# Altium schematic sheet LM2596S_5.0.SchDoc
size A4; SheetNumber: 1; SheetTotal: 1
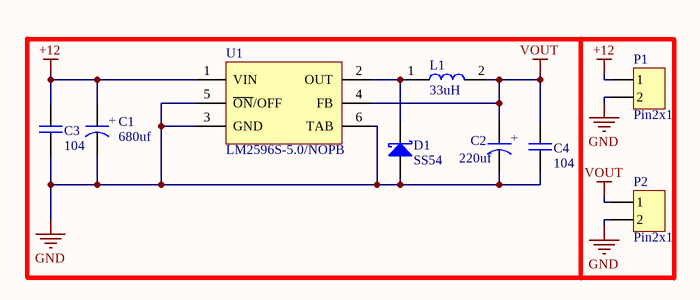
[diagram p0: LM2596S_5.0.SchDoc]

## Parts
C1  680uf  [CAP-SMD-B]
C2  220uf  [CAP-SMD-B]
C3  104  [0603C]
C4  104  [0603C]
D1  SS54  [SMC]
L1  33uH  [CDRH74]
P1  Pin2x1  [5.08A-2PIN]
P2  Pin2x1  [5.08A-2PIN]
U1  LM2596S-5.0/NOPB  [TO263-5A]

## Nets
+12: C1.2 C3.2 P1.1 U1.1(VIN)
GND: C1.1 C2.1 C3.1 C4.1 D1.1 P1.2 P2.2 U1.3(GND) U1.5(~{ON}/OFF) U1.6(TAB)
VOUT: C2.2 C4.2 L1.2 P2.1 U1.4(FB)
NetD1_2: D1.2 L1.1 U1.2(OUT)

## Notes on the sheet
- (in symbol CAP-SMD) +

## Library data of the parts
C1 C2 = CAP-SMD: Supplier 1: Arrow Electronics
C3 C4 = CAP-SMT
D1 = DIO
L1 = L-CDRH74
P1 P2 = HEADER_2P
U1 = LM2596S-5.0: SIMPLE SWITCHER® Power Converter 150 KHz 3A Step-Down Voltage Regulator, 5-pin TO-263, Pb-Free; Manufacturer: Texas Instruments; PowerWise: N; PackageTopMarking: NSUZXYTTE#*LM2596S*-5.0 P+; ComponentLink1URL: http://www.ti.com/general/docs/lit/getliterature.tsp?genericPartNumber=LM2596&fileType=pdf; PackageDescription: TO-263, Molded, .400 x .390 x .180in, 5 Lead, .067in Pitch, Surface Mount; RoHS: Y; PinCount: 5; Code_JEDEC: MO-169-AB; ComponentLink1Description: Datasheet URL; PackageReference: KTT0005B; CompType: Switcher